# EAGLE design through_hole_challenge (EAGLE 9.4.2)
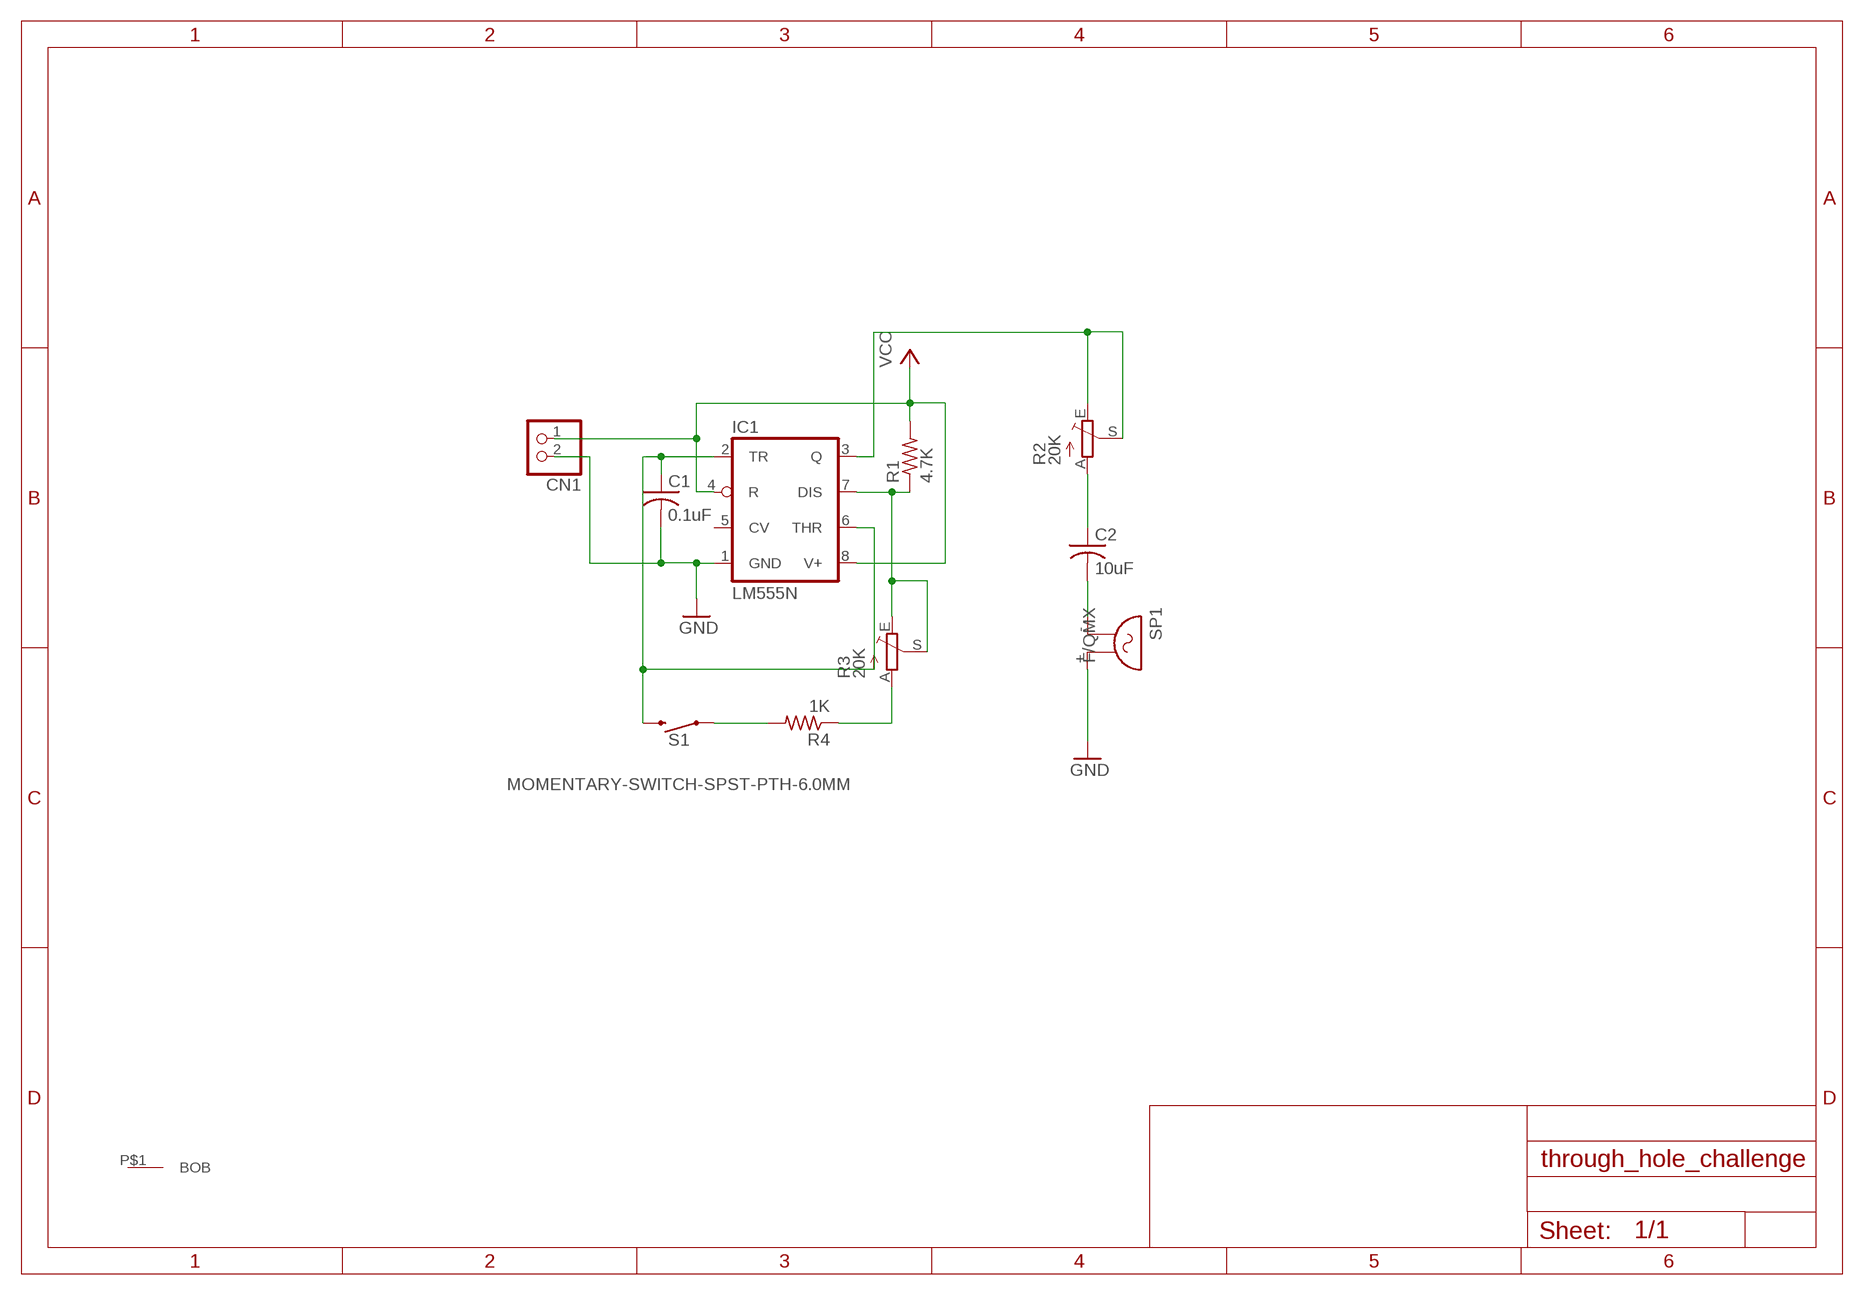
[diagram p0: schematic, sheet 1]

## Parts
C1  0.1uF  C-US050-035X075  [C050-035X075]
C2  10uF  C-US050-035X075  [C050-035X075]
CN1  JST_2PIN-THM-RA  [JST-PH-2-THM-RA]
IC1  LM555N  [DIL08]
R1  4.7K  R-US_0207/9  [0207/9]
R2  20K  TRIM_EU-B25P  [B25P]
R3  20K  TRIM_EU-B25P  [B25P]
R4  1K  R-US_0207/9  [0207/9]
S1  MOMENTARY-SWITCH-SPST-PTH-6.0MM  [TACTILE_SWITCH_PTH_6.0MM]
SP1  F/QMX  [F/QMX]
U$1  EEL_LOGO  [BOB_LOGO]

## Nets
GND: C1.2 CN1.2 IC1.1(GND) SP1.+
N$1: C1.1 IC1.2(TR) IC1.6(THR) S1.3
N$2: IC1.7(DIS) R1.1 R3.E R3.S
N$3: R3.A R4.1
N$4: IC1.3(Q) R2.E R2.S
N$5: C2.2 SP1.-
N$6: C2.1 R2.A
N$7: R4.2 S1.1
VCC: CN1.1 IC1.4(R) IC1.8(V+) R1.2
Unconnected: IC1.5(CV) U$1.P$1(BOB)

## Library data of the parts
C1 C2 = adafruit:C-US: CAPACITOR, American symbol
CN1 = adafruit:JST_2PIN: JST 2-Pin Connectors of various flavors SMT-RA (S2B-PH-SM4) 4UConnector #17311 SMT (B2B-PH-SM4) THM-RA (S2B-PH) THM (B2B-PH)
IC1 = linear:*555: TIMER
R1 R4 = adafruit:R-US_: RESISTOR, American symbol
R2 R3 = pot:TRIM_EU-: POTENTIOMETER
S1 = SparkFun-Switches:MOMENTARY-SWITCH-SPST: Momentary Switch (Pushbutton) - SPST Normally-open (NO) SPST momentary switches (buttons, pushbuttons). Variants PTH-12MM - 12mm square, through-hole Momentary Pushbutton Switch - 12mm Square <https://www.sparkfun.com/products/9190> (COM-09190) PTH-6.0MM, PTH-6.0MM-KIT - 6.0mm square, through-hole Mini Pushbutton Switch <https://www.sparkfun.com/products/97> (COM-00097) KIT package intended for soldering kit's - only one side of pads' copper is exposed. PTH-RIGHT-ANGLE-KIT - Right-angle, through-hole Right Angle Tactile Button <https://www.sparkfun.com/products/10791> - Used on SparkFun BigTime Watch Kit <https://www.sparkfun.com/products/11734> SMD-12MM - 12mm square, surface-mount Tactile Button - SMD (12mm) <https://www.sparkfun.com/products/12993> (COM-12993) Used on SparkFun PicoBoard <https://www.sparkfun.com/products/11888> SMD-4.5MM - 4.5mm Square Trackball Switch Used on SparkFun Blackberry Trackballer Breakout <https://www.sparkfun.com/products/13169> SMD-4.6MMX2.8MM - 4.60mm x 2.80mm, surface mount Used on SparkFun SAMD21 Mini Breakout <https://www.sparkfun.com/products/13664> SMD-5.2MM, SMD-5.2-REDUNDANT - 5.2mm square, surface-mount Mini Pushbutton Switch - SMD <https://www.sparkfun.com/products/8720> (COM-08720) Used on Arduino Pro Mini <https://www.sparkfun.com/products/11114> REDUNDANT package connects both switch circuits together SMD-6.0X3.5MM - 6.0 x 3.5mm, surface mount Momentary Reset Switch SMD <https://www.sparkfun.com/products/8229> (COM-08229) SMD-6.2MM-TALL - 6.2mm square, surface mount Tactile Button - SMD (6mm) <https://www.sparkfun.com/products/12992> Used on SparkFun Digital Sandbox <https://www.sparkfun.com/products/12651> SMD-RIGHT-ANGLE - Right-angle, surface mount Used on SparkFun Block for Intel® Edison - Arduino <https://www.sparkfun.com/products/13036>; PROD_ID: SWCH-08441; SF_SKU: COM-00097
SP1 = buzzer:F/QMX: BUZZER Source: Buerklin; OC_FARNELL: unknown; OC_NEWARK: unknown
U$1 = bob:EEL_LOGO

## Board
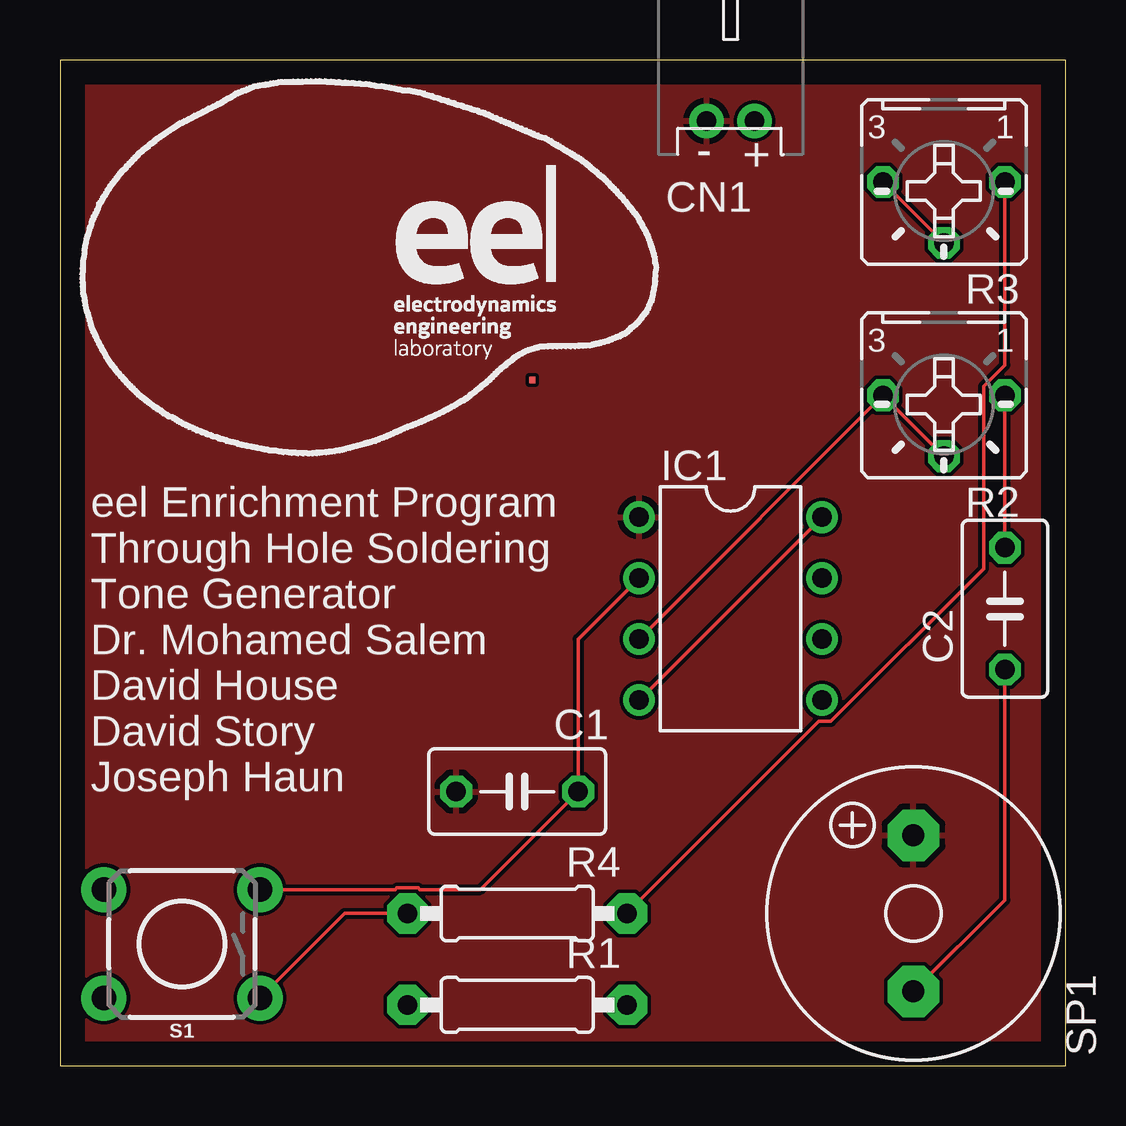
[diagram p1: board, top side]
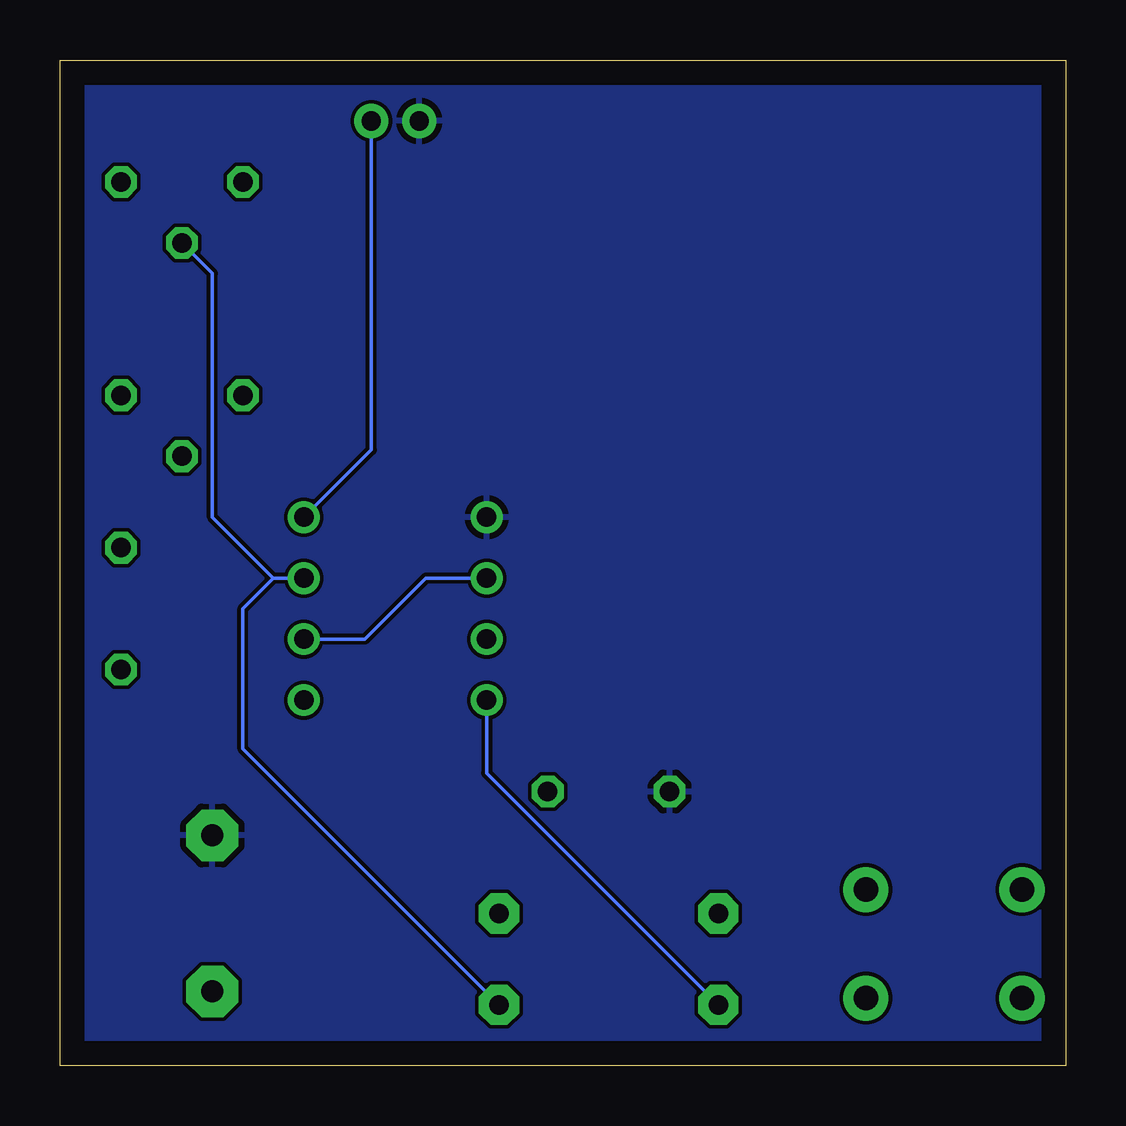
[diagram p2: board, bottom side, seen from below]

Size 41.91 x 41.91 mm. Coordinates in mm from the lower left corner, seen from the top.
Outline: 0,0 41.91,0 41.91,41.91 0,41.91 0,0
Copper layers (1*16): Top 0.035mm / dielectric 1.5mm / Bottom 0.035mm
Design rules "default": minimum track width 6mil, minimum drill 0.35mm, track to track 6mil, track to pad 6mil, pad to pad 6mil, via to via 6mil, smd to smd 6mil, copper to edge 40mil, drill to drill 6mil, minimum pad ring 10mil, minimum via ring 8mil, stop-mask expansion 4mil, vias tented up to drill 0mil, thermal gap 10mil

### Footprints (pad centres in the part's own frame; a part is rotated, then mirrored left to right if it is on the bottom)
C050-035X075 = drill 0.813 octagon: 1 -2.54,0; 2 2.54,0
JST-PH-2-THM-RA = drill 0.8 pad 1.422: 1 1,0; 2 -1,0
DIL08 = drill 0.813 pad 1.27: 1 -3.81,-3.81; 2 -1.27,-3.81; 3 1.27,-3.81; 4 3.81,-3.81; 5 3.81,3.81; 6 1.27,3.81; 7 -1.27,3.81; 8 -3.81,3.81
0207/9 = drill 0.813 pad 1.676 octagon: 1 -4.572,0; 2 4.572,0
B25P = drill 0.813 octagon: A -2.54,0; E 2.54,0; S 0,2.54
TACTILE_SWITCH_PTH_6.0MM = drill 1.016 pad 1.88: 1 -3.251,2.261; 2 3.251,2.261; 3 -3.251,-2.261; 4 3.251,-2.261
F/QMX = drill 0.914 pad 2.159 octagon: + 3.251,0; - -3.251,0
BOB_LOGO = smd 0.254 x 0.254: P$1 19.05,3.81

### Placement (x,y rotation side)
C1  19.05,11.43 180 top
C2  39.37,19.05 270 top
CN1  27.94,39.37 0 top
IC1  27.94,19.05 270 top
R1  19.05,2.54 180 top
R2  36.83,27.94 180 top
R3  36.83,36.83 180 top
R4  19.05,6.35 180 top
S1  5.08,5.08 180 top
SP1  35.56,6.35 90 top
U$1  0.64,24.77 0 top

### Tracks (layer width: path | path; a pad name or v marks a point on that pad's centre or on a via)
GND
  pour Bottom: 0,0 0,41.91 41.91,41.91 41.91,0
  pour Top: 0,0 0,41.91 41.91,41.91 41.91,0
N$1
  Top 0.152: S1.3 13.96,7.34 14.04,7.42 14.92,7.42 15,7.34 17.5,7.34 C1.1 21.59,17.78 IC1.2
  Bottom 0.152: IC1.2 26.67,20.32 29.21,17.78 IC1.6
N$2
  Top 0.152: R3.E R3.S
  Bottom 0.152: R1.1 34.29,13.21 34.29,19.05 33.02,20.32 | IC1.7 33.02,20.32 | 33.02,20.32 35.56,22.86 35.56,33.02 R3.S
N$3
  Top 0.152: R4.1 31.62,14.35 32.12,14.35 38.48,20.71 38.48,28.31 39.37,29.2 R3.A
N$4
  Top 0.152: IC1.3 R2.E R2.S
N$5
  Top 0.152: SP1.- 39.37,6.91 C2.2
N$6
  Top 0.152: R2.A C2.1
N$7
  Top 0.152: S1.1 11.86,6.35 R4.2
VCC
  Top 0.152: IC1.4 IC1.8
  Bottom 0.152: IC1.4 24.13,12.19 R1.2 | IC1.8 28.94,25.67 CN1.1

### Text on the board
tPlace: eel Enrichment Program / Through Hole Soldering / Tone Generator / Dr. Mohamed Salem / David House / David Story / Joseph Haun